# EAGLE schematic mk2.5 (EAGLE 7.6.0)
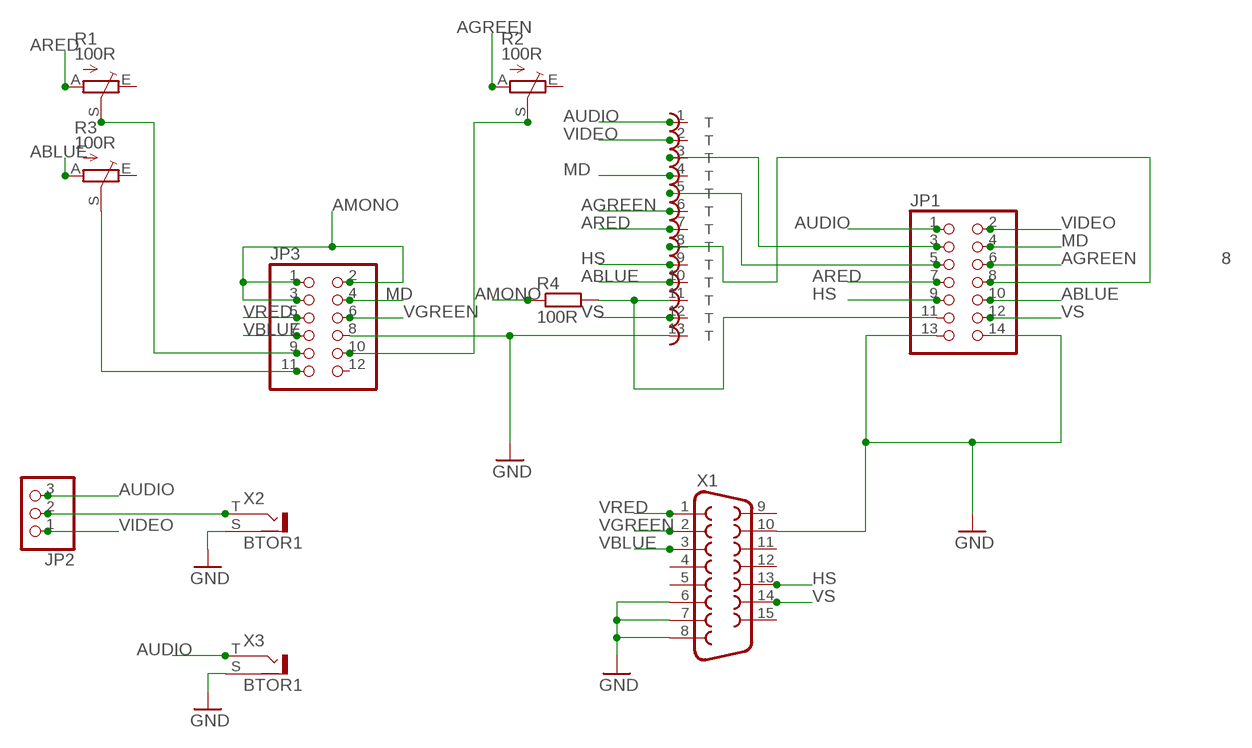
[diagram p0: schematic, sheet 1]

## Parts
J1  DIN13T  [ADADS]
JP1  PINHD-2X7  [2X07]
JP2  PINHD-1X3  [1X03]
JP3  PINHD-2X6  [2X06]
R1  100R  TRIM_EU-CA6H  [CA6H]
R2  100R  TRIM_EU-CA6H  [CA6H]
R3  100R  TRIM_EU-CA6H  [CA6H]
R4  100R  R-EU_0204/5  [0204/5]
X1  F15HDV  [HDF15V]
X2  BTOR1  [BTOR1]
X3  BTOR1  [BTOR1]

## Nets
8: J1.8 JP1.8
ABLUE: J1.10 JP1.10 R3.A
AGREEN: J1.6 JP1.6 R2.A
AMONO: JP3.1 JP3.2 JP3.3 R4.1
ARED: J1.7 JP1.7 R1.A
AUDIO: J1.1 JP1.1 JP2.3 X3.T
GND: J1.13 JP1.13 JP1.14 JP3.8 X1.6 X1.7 X1.8 X1.10 X2.S X3.S
HS: J1.9 JP1.9 X1.13
MD: J1.4 JP1.4 JP3.4
N$1: J1.11 JP1.11 R4.2
N$2: JP3.9 R1.S
N$4: JP3.10 R2.S
N$5: JP2.2 X2.T
N$6: JP3.11 R3.S
N$7: J1.3 JP1.3
N$8: J1.5 JP1.5
VBLUE: JP3.7 X1.3
VGREEN: JP3.6 X1.2
VIDEO: J1.2 JP1.2 JP2.1
VRED: JP3.5 X1.1
VS: J1.12 JP1.12 X1.14
Unconnected: JP3.12 R1.E R2.E R3.E X1.4 X1.5 X1.9 X1.11 X1.12 X1.15 X2.S@1 X2.S@2 X2.S@3 X3.S@1 X3.S@2 X3.S@3

## Library data of the parts
J1 = ube:DIN13
JP1 = pinhead:PINHD-2X7: PIN HEADER
JP2 = pinhead:PINHD-1X3: PIN HEADER
JP3 = ubepin:PINHD-2X6: PIN HEADER
R1-R3 = pot:TRIM_EU-: POTENTIOMETER
R4 = resistor:R-EU_: RESISTOR, European symbol
X1 = con-subd:F15: SUB-D; OC_FARNELL: unknown; OC_NEWARK: unknown
X2 X3 = con-lumberg:BTOR1: RCA connectors according to JEITA RC-5231 Cinch RCA-Einbaukupplung nach JEITA RC-5231, stehende Ausführung Source: http://www.lumberg.de/Produkte/PDFs/BTOR1.pdf; OC_FARNELL: 1217030; OC_NEWARK: unknown

## Net classes
0 default: width 0.406 mm